# Altium schematic sheet 1_panel.schdoc: Solar Cells
size A4; Engineer: Eng_2_ALT; SheetNumber: 2; SheetTotal: 2; Designed by: Marina Duailibe; Version: v0.1
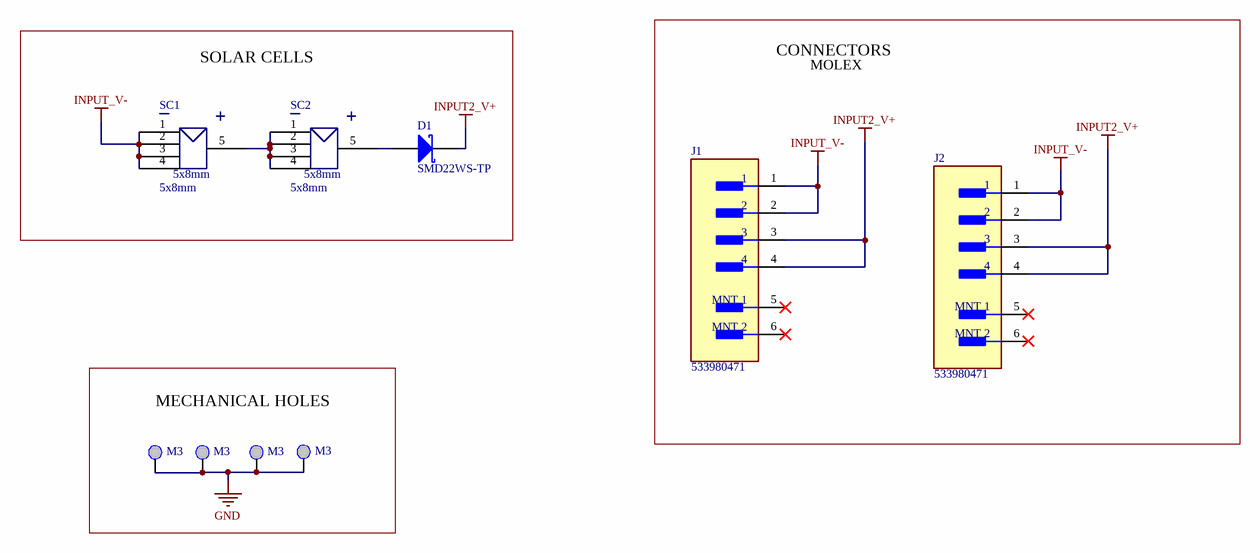
[diagram p0: 1_panel.schdoc]

## Parts
D1  SMD22WS-TP  [SOD323F]
J1  533980471  [FP-533980471-MFG]
J2  533980471  [FP-533980471-MFG]
MEC1  M3  [HOLE6x6mm]  (no BOM)
MEC2  M3  [HOLE6x6mm]  (no BOM)
MEC3  M3  [HOLE6x6mm]  (no BOM)
MEC4  M3  [HOLE6x6mm]  (no BOM)
SC1  5x8mm  [SOLAR_CELL_SIDES]
SC2  5x8mm  [SOLAR_CELL_SIDES]

## Blocks framed on the sheet
SOLAR CELLS: D1 SC1 SC2
CONNECTORS: J1 J2
MECHANICAL HOLES: MEC1-MEC4

## Nets
GND: MEC1.0 MEC2.0 MEC3.0 MEC4.0
INPUT2_V+: D1.1(K) J1.3 J1.4 J2.3 J2.4
INPUT_V-: J1.1 J1.2 J2.1 J2.2 SC1.1(V+) SC1.2(V-) SC1.3 SC1.4
NetD1_2: D1.2(A) SC2.5
NetSC1_5: SC1.5 SC2.1(V+) SC2.2(V-) SC2.3 SC2.4

Not connected (* = marked no-connect by the designer): J1 5(MNT_1)* 6(MNT_2)*; J2 5(MNT_1)* 6(MNT_2)*

## Notes on the sheet
- MOLEX
- Project:
- SpaceLab - Federal University of Santa Catarina
- Title:
- Designed by:
- Project Code:
- Date:
- Revision:
- Sheet
- of
- Size:
- A4
- (in symbol SOLAR CELL) _; +

## Library data of the parts
D1 = DIODE_SCHOTTKY_20V_2A_SMD22WS-TP: Diode Schottky 20 V 2A Surface Mount SOD-323; Partnumber: SMD22WS-TP
J1 J2 = CMP-04776-000105-1: CONN HEADER SMD 4POS 1.25MM; Manufacturer: Molex; Conn Gender: Male; Conn Orientation: Vertical; Standoff Height: 0.05mm; Number Of Contacts: 4; Current Rating: 1A; Voltage Rating: 125V; Package: 0; ComponentLink2Description: Datasheet; ComponentLink2URL: https://www.molex.com/pdm_docs/ps/PS-51021-024-001.pdf; Ambient Temperature Range Low: -40°C; Category: Conn; Automotive: No; Number Of Rows: 1; Device Class L3: unset; Ambient Temperature Range High: +105°C; Height: 5.1mm; Lead Free: Yes; Pitch: 1.25mm; Contact Material: Tin; Footprint Url: https://www.molex.com/pdm_docs/sd/533980471_sd.pdf; Octopart: https://octopart.com/53398-0471-molex-655296; Temperature Range Low: -40°C; Device Class L2: Headers and Wire Housings; Temperature: -40°C to +105°C; Digikey Description: CONN HEADER SMD 4POS 1.25MM; RoHS: TRUE; Manufacturer Part Number: 533980471; Device Class L1: Connectors; Temperature Range High: +105°C
MEC1-MEC4 = M3 hole
SC1 SC2 = SOLAR CELL: Manufacturer: Yim Space; PDM Number: SC-3GA-3